# Altium schematic sheet CTR-Lower-Main-Board-Rev-C-BTLE.SchDoc: ZoZbot Lower Main Board - BTLE
size B; Author: RMG; Organization: OLogic, Inc.; DocumentNumber: LMB2; Revision: C; SheetNumber: 2; SheetTotal: 10; PageSetup: Record=PageOptions|CenterHorizontal=True|CenterVertical=True|PrintScale=0.70|XCorrection=1.00|YCorrection=1.00|PrintKind=0|BorderSize=5000000|LeftOffset=0|BottomOffset=0|Orientation=2|PaperLength=1000|PaperWidth=1000|Scale=100|PaperSource=15|PrintQuality=600|MediaType=1|DitherType=10|PrintScaleMode=1|PaperKind=Letter|PaperIndex=1
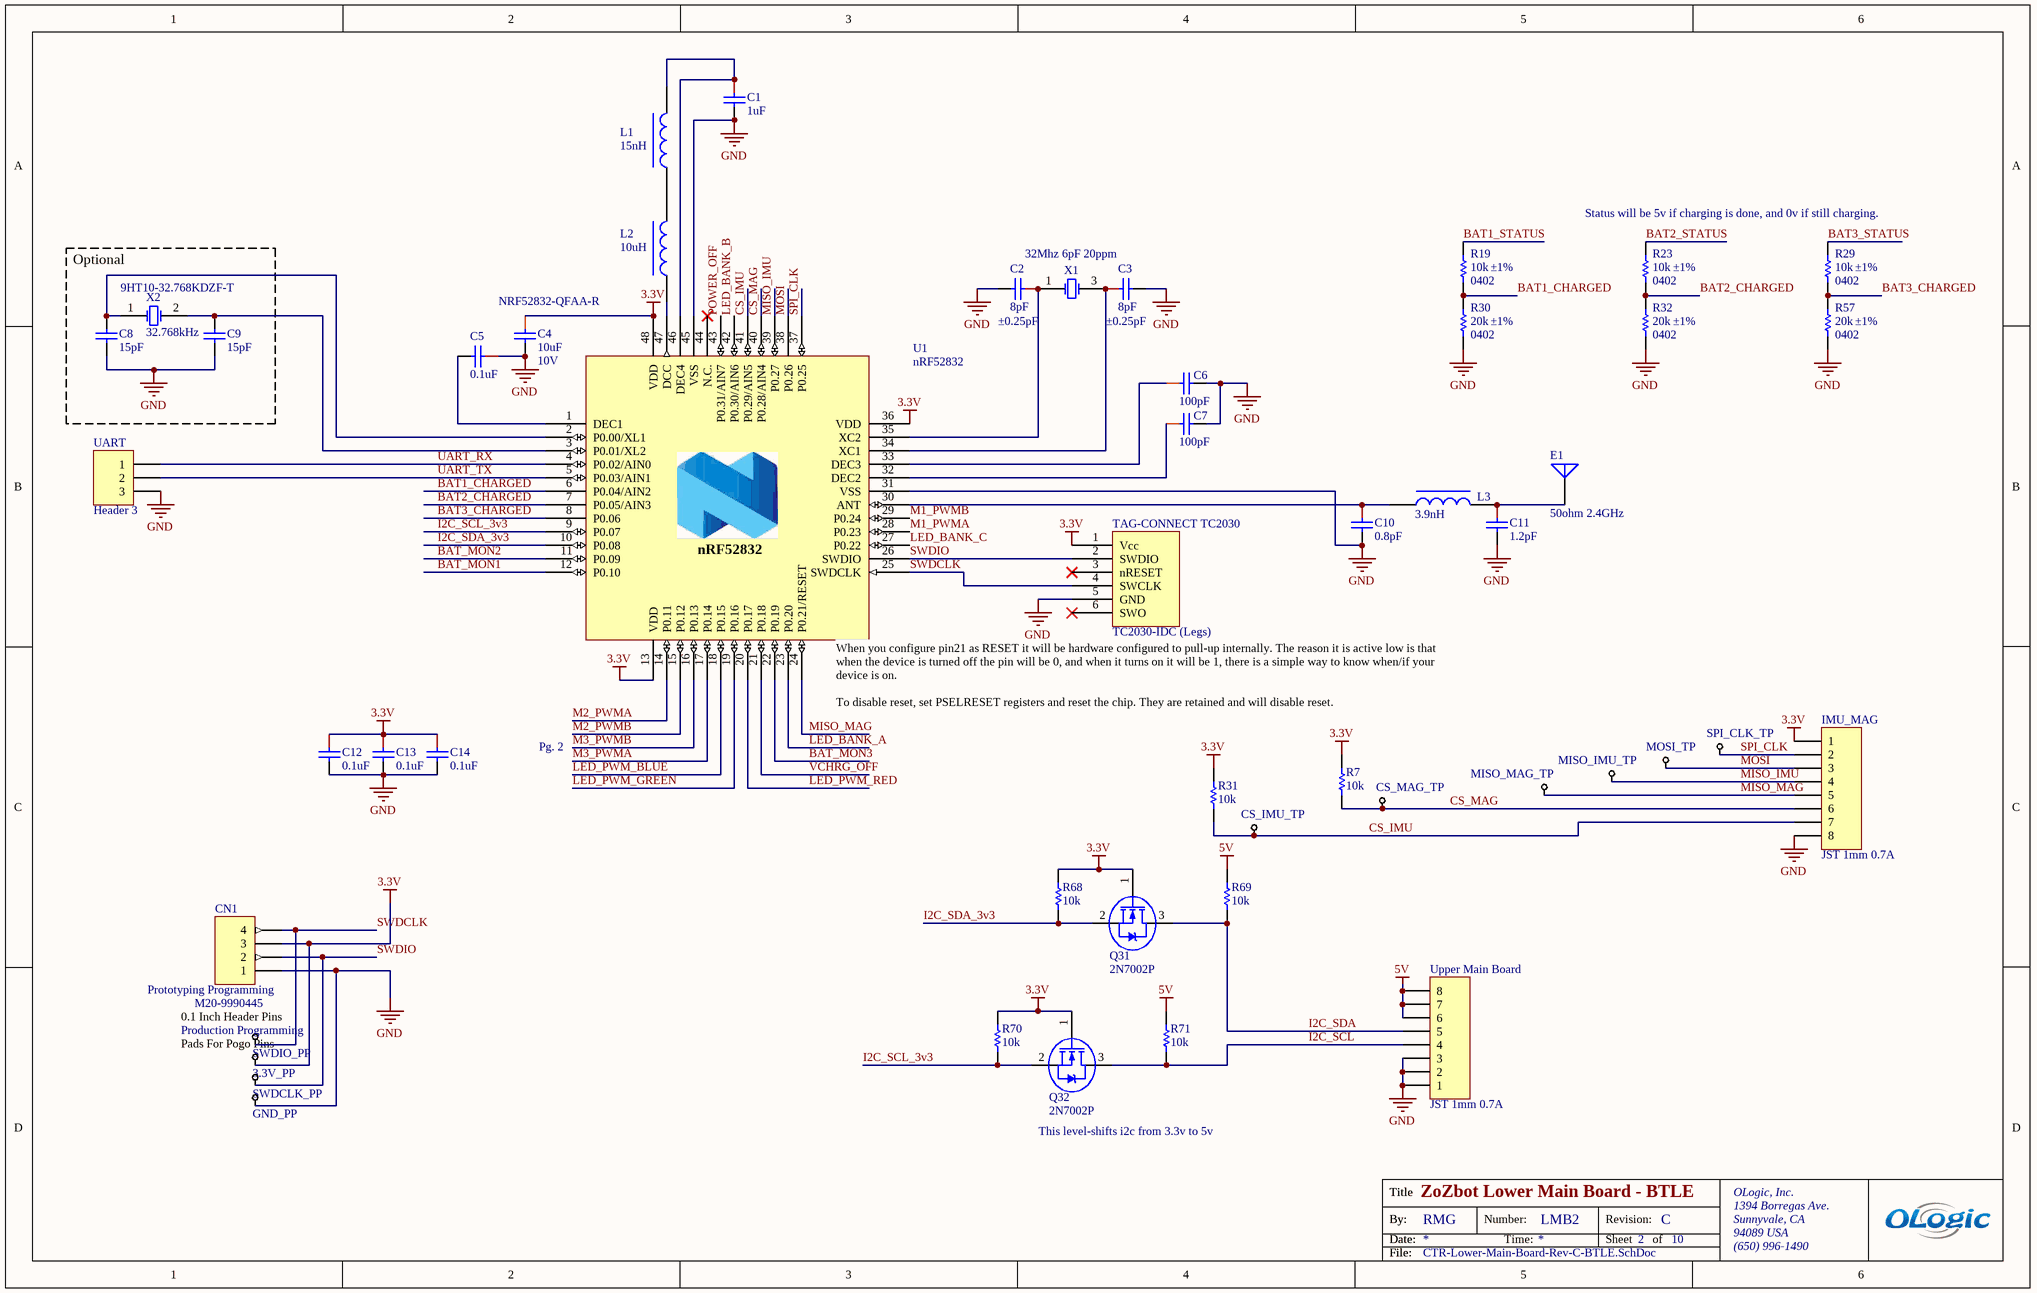
[diagram p0: CTR-Lower-Main-Board-Rev-C-BTLE.SchDoc]

## Parts
3.3V_PP  Test Point  [TestPoint-MD]  (value not drawn)  (no BOM)
C1  1uF  [CAPC0402(1005)_N]
C2  Capacitance: 8pF  Tolerance: ±0.25pF  [CAPC0402(1005)_N]  (hidden comment: CAP CER 8PF 50V +/- 0.25PF C0G 0402)
C3  Capacitance: 8pF  Tolerance: ±0.25pF  [CAPC0402(1005)_N]  (hidden comment: CAP CER 8PF 50V +/- 0.25PF C0G 0402)
C4  10uF  Voltage - Rated: 10V  [CAPC0805(2012)_L]
C5  0.1uF  [CAPC0402(1005)_N]
C6  100pF  [CAPC0402(1005)_N]
C7  100pF  [CAPC0402(1005)_N]
C8  15pF  [CAPC0402(1005)_N]
C9  15pF  [CAPC0402(1005)_N]
C10  0.8pF  [CAPC0402(1005)_N]
C11  1.2pF  [CAPC0402(1005)_N]
C12  0.1uF  [CAPC0402(1005)_N]
C13  0.1uF  [CAPC0402(1005)_N]
C14  0.1uF  [CAPC0402(1005)_N]
CN1  Prototyping Programming  Manufacturer Part Number: M20-9990445  [HDR1X4]
CS_IMU_TP  Test Point  [TestPoint-TH 42 mil]  (value not drawn)  (no BOM)
CS_MAG_TP  Test Point  [TestPoint-TH 42 mil]  (value not drawn)  (no BOM)
E1  50ohm 2.4GHz  [ANT-Trace-nRF51822]  (no BOM)
GND_PP  Test Point  [TestPoint-MD]  (value not drawn)  (no BOM)
IMU_MAG  JST 1mm 0.7A  [JST-BM08B-SRSS-TB]
L1  15nH  [IND-0402]
L2  10uH  [IND-0603]
L3  3.9nH  [IND-0402]
MISO_IMU_TP  Test Point  [TestPoint-TH 42 mil]  (value not drawn)  (no BOM)
MISO_MAG_TP  Test Point  [TestPoint-TH 42 mil]  (value not drawn)  (no BOM)
MOSI_TP  Test Point  [TestPoint-TH 42 mil]  (value not drawn)  (no BOM)
Q31  2N7002P  [SOT23]
Q32  2N7002P  [SOT23]
R7  10K  [RESC0402(1005)_N]
R19  Tolerance: ±1%  Supplier Device Package: 0402  [RESC0402(1005)_N]  (hidden comment: 10K)
R23  Tolerance: ±1%  Supplier Device Package: 0402  [RESC0402(1005)_N]  (hidden comment: 10K)
R29  Tolerance: ±1%  Supplier Device Package: 0402  [RESC0402(1005)_N]  (hidden comment: 10K)
R30  Tolerance: ±1%  Supplier Device Package: 0402  Resistance (Ohms): 20k  [RESC0402(1005)_N]  (hidden comment: 20K 0402)
R31  10K  [RESC0402(1005)_N]
R32  Tolerance: ±1%  Supplier Device Package: 0402  Resistance (Ohms): 20k  [RESC0402(1005)_N]  (hidden comment: 20K 0402)
R57  Tolerance: ±1%  Supplier Device Package: 0402  Resistance (Ohms): 20k  [RESC0402(1005)_N]  (hidden comment: 20K 0402)
R68  10K  [RESC0402(1005)_N]
R69  10K  [RESC0402(1005)_N]
R70  10K  [RESC0402(1005)_N]
R71  10K  [RESC0402(1005)_N]
SPI_CLK_TP  Test Point  [TestPoint-TH 42 mil]  (value not drawn)  (no BOM)
SWDCLK_PP  Test Point  [TestPoint-MD]  (value not drawn)  (no BOM)
SWDIO_PP  Test Point  [TestPoint-MD]  (value not drawn)  (no BOM)
TAG-CONNECT_TC2030  TC2030-IDC (Legs)  [TC2030-IDC]  (no BOM)
U1  nRF52832  Manufacturer Part Number: NRF52832-QFAA-R  [QFN40P600X600X90-48N]
UART  Header 3  [HDR1X3]
Upper_Main_Board  JST 1mm 0.7A  [JST-BM08B-SRSS-TB]
X1  32Mhz 6pF 20ppm  [SMXOSC/2X1.6]
X2  32.768kHz  Manufacturer Part Number: 9HT10-32.768KDZF-T  [FC-135]

## Blocks framed on the sheet
Optional: C8 C9 X2

## Nets
3.3V: 3.3V_PP.1 C4.1 C12.1 C13.1 C14.1 CN1.3 IMU_MAG.1 Q31.1(G) Q32.1(G) R7.2 R31.2 R68.2 R70.2 TAG-CONNECT_TC2030.1(Vcc) U1.13(VDD) U1.36(VDD) U1.48(VDD)
5V: R69.2 R71.2 Upper_Main_Board.6 Upper_Main_Board.7 Upper_Main_Board.8
GND: C1.2 C2.2 C3.2 C4.2 C5.1 C6.2 C7.2 C8.1 C9.1 C10.2 C11.2 C12.2 C13.2 C14.2 CN1.1 GND_PP.1 IMU_MAG.0 IMU_MAG.8 R30.1 R32.1 R57.1 TAG-CONNECT_TC2030.5(GND) U1.31(VSS) U1.45(VSS) U1.49(GND) UART.3 Upper_Main_Board.0 Upper_Main_Board.1 Upper_Main_Board.2 Upper_Main_Board.3 X1.2(NC) X1.4(NC)
BAT1_CHARGED: R19.1 R30.2 U1.6(P0.04/AIN2)
BAT1_STATUS: R19.2
BAT2_CHARGED: R23.1 R32.2 U1.7(P0.05/AIN3)
BAT2_STATUS: R23.2
BAT3_CHARGED: R29.1 R57.2 U1.8(P0.06)
BAT3_STATUS: R29.2
BAT_MON1: U1.12(P0.10)
BAT_MON2: U1.11(P0.09)
BAT_MON3: U1.22(P0.19)
CS_IMU: CS_IMU_TP.1 IMU_MAG.7 R31.1 U1.41(P0.29/AIN5)
CS_MAG: CS_MAG_TP.1 IMU_MAG.6 R7.1 U1.40(P0.28/AIN4)
I2C_SCL: Q32.3(D) R71.1 Upper_Main_Board.4
I2C_SCL_3v3: Q32.2(S) R70.1 U1.9(P0.07)
I2C_SDA: Q31.3(D) R69.1 Upper_Main_Board.5
I2C_SDA_3v3: Q31.2(S) R68.1 U1.10(P0.08)
LED_BANK_A: U1.23(P0.20)
LED_BANK_B: U1.42(P0.30/AIN6)
LED_BANK_C: U1.27(P0.22)
LED_PWM_BLUE: U1.18(P0.15)
LED_PWM_GREEN: U1.19(P0.16)
LED_PWM_RED: U1.20(P0.17)
M1_PWMA: U1.28(P0.23)
M1_PWMB: U1.29(P0.24)
M2_PWMA: U1.14(P0.11)
M2_PWMB: U1.15(P0.12)
M3_PWMA: U1.17(P0.14)
M3_PWMB: U1.16(P0.13)
MISO_IMU: IMU_MAG.4 MISO_IMU_TP.1 U1.39(P0.27)
MISO_MAG: IMU_MAG.5 MISO_MAG_TP.1 U1.24(P0.21/RESET)
MOSI: IMU_MAG.3 MOSI_TP.1 U1.38(P0.26)
POWER_OFF: U1.43(P0.31/AIN7)
SPI_CLK: IMU_MAG.2 SPI_CLK_TP.1 U1.37(P0.25)
SWDCLK: CN1.4 SWDIO_PP.1 TAG-CONNECT_TC2030.4(SWCLK) U1.25(SWDCLK)
SWDIO: CN1.2 SWDCLK_PP.1 TAG-CONNECT_TC2030.2(SWDIO) U1.26(SWDIO)
UART_RX: U1.4(P0.02/AIN0) UART.1
UART_TX: U1.5(P0.03/AIN1) UART.2
VCHRG_OFF: U1.21(P0.18)
NetC1_1: C1.1 L1.2 U1.46(DEC4)
NetC2_1: C2.1 U1.35(XC2) X1.1(OSC1)
NetC3_1: C3.1 U1.34(XC1) X1.3(OSC2)
NetC5_2: C5.2 U1.1(DEC1)
NetC6_1: C6.1 U1.33(DEC3)
NetC7_1: C7.1 U1.32(DEC2)
NetC8_2: C8.2 U1.2(P0.00/XL1) X2.1(OSC1)
NetC9_2: C9.2 U1.3(P0.01/XL2) X2.2(OSC2)
NetC10_1: C10.1 L3.1 U1.30(ANT)
NetC11_1: C11.1 E1.1(A) L3.2
NetL1_1: L1.1 L2.2
NetL2_1: L2.1 U1.47(DCC)

Not connected (* = marked no-connect by the designer): TAG-CONNECT_TC2030 3(nRESET)* 6(SWO)*; U1 44(N.C.)*

## Notes on the sheet
- Status will be 5v if charging is done, and 0v if still charging.
- Pg. 2
- (near U1) When you configure pin21 as RESET it will be hardware configured to pull-up internally. The reason it is active low is that when the device is turned off the pin will be 0, and when it turns on it will be 1, there is a simple way to know when/if your device is on.
  To disable reset, set PSELRESET registers and reset the chip. They are retained and will disable reset.
- 0.1 Inch Header Pins
- Pads For Pogo Pins
- Production Programming
- This level-shifts i2c from 3.3v to 5v
- Title
- By:
- Date:
- Number:
- Time:
- Revision:
- Sheet
- of
- OLogic, Inc.
- 1394 Borregas Ave.
- Sunnyvale, CA
- 94089 USA
- File:
- (650) 996-1490

## Library data of the parts
3.3V_PP CS_IMU_TP CS_MAG_TP GND_PP MISO_IMU_TP MISO_MAG_TP MOSI_TP SPI_CLK_TP SWDCLK_PP SWDIO_PP = TestPoint, small
C1 = CAP CER 1UF 16V 10% X5R 0402: 1UF 0402; Manufacturer: TDK Corporation; Manufacturer Part Number: C1005X5R1C105K050BC; Capacitance: 1.0µF; Tolerance: ±10%; Voltage - Rated: 16V; Temperature Coefficient: X5R; ClassName: CPU; Supplier 1: Digi-Key; RoHS: RoHS Compliant; Category: Capacitors; Stock 1: 490204; Pricing 1: 1=0.12, 10=0.08, 100=0.038, 250=0.032, 500=0.0268, 1000=0.022, 5000=0.0186 (USD); Packaging: Cut Tape (CT); Mounting Type: Surface Mount, MLCC; Operating Temperature: -55°C ~ 85°C; Applications: General Purpose; Ratings: -; Package / Case: 0402 (1005 Metric); Size / Dimension: 0.039" L x 0.020" W (1.00mm x 0.50mm); Height - Seated (Max): -; Thickness (Max): 0.022" (0.55mm); Lead Spacing: -; Features: -; Lead Style: -; ComponentLink1URL: http://product.tdk.com/en/catalog/datasheets/mlcc_commercial_general_en.pdf; ComponentLink1Description: http://product.tdk.com/en/catalog/datasheets/mlcc_commercial_general_en.pdf; Supplier Part Number 1: 445-4978-1-ND
C2 C3 = CAP CER 8PF 50V +/- 0.25PF C0G 0402: 8pF 0402; Manufacturer: TDK Corporation; Manufacturer Part Number: C1005C0G1H080C050BA; Temperature Coefficient: C0G, NP0; Supplier 1: Digi-Key; RoHS: RoHS Compliant; Category: Capacitors; Stock 1: 65983; Pricing 1: 1=0.1, 10=0.026, 100=0.0121, 250=0.00992, 500=0.00848, 1000=0.0066, 5000=0.0055 (USD); Packaging: Cut Tape (CT); Voltage - Rated: 50V; Mounting Type: Surface Mount, MLCC; Operating Temperature: -55°C ~ 125°C; Applications: General Purpose; Ratings: -; Package / Case: 0402 (1005 Metric); Size / Dimension: 0.039" L x 0.020" W (1.00mm x 0.50mm); Height - Seated (Max): -; Thickness (Max): 0.022" (0.55mm); Lead Spacing: -; Features: -; Lead Style: -; ComponentLink1URL: https://product.tdk.com/info/en/catalog/datasheets/mlcc_commercial_general_en.pdf; ComponentLink1Description: https://product.tdk.com/info/en/catalog/datasheets/mlcc_commercial_general_en.pdf; Supplier Part Number 1: 445-4890-1-ND; Creator: osman
C4 = CAP CER 10UF 10V Y5V 0805: 10uF 0805 10V; Manufacturer: Taiyo Yuden; Manufacturer Part Number: LMK212F106ZG-T; Capacitance: 10µF; Tolerance: -20%, +80%; Temperature Coefficient: Y5V (F); Supplier 1: Digi-Key; RoHS: RoHS Compliant; Category: Capacitors; Stock 1: 194456; Pricing 1: 1=0.17, 10=0.115, 50=0.0662, 100=0.0546, 250=0.046, 500=0.03852, 1000=0.03163 (USD); Packaging: Cut Tape (CT); Mounting Type: Surface Mount, MLCC; Operating Temperature: -30°C ~ 85°C; Applications: General Purpose; Ratings: -; Package / Case: 0805 (2012 Metric); Size / Dimension: 0.079" L x 0.049" W (2.00mm x 1.25mm); Height - Seated (Max): -; Thickness (Max): 0.053" (1.35mm); Lead Spacing: -; Features: -; Lead Style: -; ComponentLink1URL: http://www.yuden.co.jp/or/product/category/capacitor/LMK212F106ZG-T.pdf; ComponentLink1Description: http://www.yuden.co.jp/or/product/category/capacitor/LMK212F106ZG-T.pdf; Supplier Part Number 1: 587-1312-1-ND
C5 C12-C14 = CAP CER 0.1UF 50V 10% X7R 0402: 0.1uF 0402 50V; Manufacturer: TDK Corporation; Manufacturer Part Number: CGA2B3X7R1H104K050BB; Capacitance: 0.1µF; Tolerance: ±10%; Temperature Coefficient: X7R; Supplier 1: Digi-Key; RoHS: RoHS Compliant; Category: Capacitors; Stock 1: 1584397; Pricing 1: 1=0.16, 10=0.11, 100=0.0523, 250=0.044, 500=0.03686, 1000=0.03025, 5000=0.02558 (USD); Packaging: Cut Tape (CT); Voltage - Rated: 50V; Mounting Type: Surface Mount, MLCC; Operating Temperature: -55°C ~ 125°C; Applications: Automotive; Ratings: AEC-Q200; Package / Case: 0402 (1005 Metric); Size / Dimension: 0.039" L x 0.020" W (1.00mm x 0.50mm); Height - Seated (Max): -; Thickness (Max): 0.022" (0.55mm); Lead Spacing: -; Features: -; Lead Style: -; ComponentLink1URL: http://product.tdk.com/en/catalog/datasheets/mlcc_automotive_general_en.pdf; ComponentLink1Description: http://product.tdk.com/en/catalog/datasheets/mlcc_automotive_general_en.pdf; Supplier Part Number 1: 445-6899-1-ND; Creator: osman
  C12-C14: ClassName: CPU
C6 C7 = CAP CER 100PF 50V 5% NP0 0402: 100pF 0402 50V; Manufacturer: Murata Electronics North America; Manufacturer Part Number: GRM1555C1H101JA01D; Tolerance: ±5%; Temperature Coefficient: C0G, NP0; ClassName: CPU; Supplier 1: Digi-Key; RoHS: RoHS Compliant; Category: Capacitors; Stock 1: 1246257; Pricing 1: 1=0.1, 10=0.013, 50=0.007, 100=0.0059, 250=0.00488, 500=0.00416, 1000=0.00324, 5000=0.0027 (USD); Packaging: Cut Tape (CT); Capacitance: 100pF; Voltage - Rated: 50V; Mounting Type: Surface Mount, MLCC; Operating Temperature: -55°C ~ 125°C; Applications: General Purpose; Ratings: -; Package / Case: 0402 (1005 Metric); Size / Dimension: 0.039" L x 0.020" W (1.00mm x 0.50mm); Height - Seated (Max): -; Thickness (Max): 0.022" (0.55mm); Lead Spacing: -; Features: -; Lead Style: -; ComponentLink1URL: http://www.murata.com/~/media/webrenewal/support/library/catalog/products/capacitor/mlcc/c02e.ashx; ComponentLink1Description: http://www.murata.com/~/media/webrenewal/support/library/catalog/products/capacitor/mlcc/c02e.ashx; Supplier Part Number 1: 490-5922-1-ND
C8 = Capacitor: Manufacturer: Murata Electronics North America; Manufacturer Part Number: GRM1555C1H150JA01D; PN: 490-5888-1-ND; Vendor: Digikey; Tolerance: ±5%; Voltage - Rated: 50V; Temperature Coefficient: C0G, NP0; ClassName: CPU; Supplier 1: Digi-Key; Supplier Part Number 1: 490-5888-1-ND; RoHS: RoHS Compliant; Category: Capacitors; Stock 1: 332846; Pricing 1: 1=0.1, 10=0.013, 50=0.007, 100=0.0059, 250=0.0048, 500=0.00412, 1000=0.00315, 5000=0.00263 (USD); Packaging: Cut Tape (CT); Capacitance: 15pF; Mounting Type: Surface Mount, MLCC; Operating Temperature: -55°C ~ 125°C; Applications: General Purpose; Ratings: -; Package / Case: 0402 (1005 Metric); Size / Dimension: 0.039" L x 0.020" W (1.00mm x 0.50mm); Height - Seated (Max): -; Thickness (Max): 0.022" (0.55mm); Lead Spacing: -; Features: -; Lead Style: -; ComponentLink1URL: http://www.murata.com/~/media/webrenewal/support/library/catalog/products/capacitor/mlcc/c02e.ashx; ComponentLink1Description: http://www.murata.com/~/media/webrenewal/support/library/catalog/products/capacitor/mlcc/c02e.ashx
C9 = Capacitor: Manufacturer: TDK; MPN: C1608C0G1H150J080AA; Manufacturer Part Number: GRM1555C1H150JA01D; PN: 445-1271-1-ND; Vendor: Digikey; Tolerance: ±5%; Voltage - Rated: 50V; Temperature Coefficient: C0G, NP0; ClassName: CPU; Supplier 1: Digi-Key; Supplier Part Number 1: 490-5888-1-ND; RoHS: RoHS Compliant; Category: Capacitors; Stock 1: 332846; Pricing 1: 1=0.1, 10=0.013, 50=0.007, 100=0.0059, 250=0.0048, 500=0.00412, 1000=0.00315, 5000=0.00263 (USD); Packaging: Cut Tape (CT); Capacitance: 15pF; Mounting Type: Surface Mount, MLCC; Operating Temperature: -55°C ~ 125°C; Applications: General Purpose; Ratings: -; Package / Case: 0402 (1005 Metric); Size / Dimension: 0.039" L x 0.020" W (1.00mm x 0.50mm); Height - Seated (Max): -; Thickness (Max): 0.022" (0.55mm); Lead Spacing: -; Features: -; Lead Style: -; ComponentLink1URL: http://www.murata.com/~/media/webrenewal/support/library/catalog/products/capacitor/mlcc/c02e.ashx; ComponentLink1Description: http://www.murata.com/~/media/webrenewal/support/library/catalog/products/capacitor/mlcc/c02e.ashx
C10 = CAP CER 0.8pF 50V 0402: 0.8pF 0402; Manufacturer: Murata Electronics North America; Manufacturer Part Number: GJM1555C1HR80WB01D; Capacitance: 0.80pF; Tolerance: ±0.05pF; Voltage - Rated: 50V; Temperature Coefficient: C0G, NP0; Supplier 1: Digi-Key; RoHS: RoHS Compliant; Category: Capacitors; Stock 1: 18923; Pricing 1: 1=0.26, 10=0.216, 50=0.1216, 100=0.108, 250=0.081, 500=0.07156, 1000=0.06345, 5000=0.05265 (USD); Packaging: Cut Tape (CT); Part Status: Active; Operating Temperature: -55°C ~ 125°C; Features: High Q, Low Loss; Ratings: -; Applications: RF, Microwave, High Frequency; Failure Rate: *; Mounting Type: Surface Mount, MLCC; Package / Case: 0402 (1005 Metric); Size / Dimension: 0.039" L x 0.020" W (1.00mm x 0.50mm); Height - Seated (Max): -; Thickness (Max): 0.022" (0.55mm); Lead Spacing: -; Lead Style: -; ComponentLink1URL: http://www.murata.com/~/media/webrenewal/support/library/catalog/products/capacitor/mlcc/c02e.pdf; ComponentLink1Description: http://www.murata.com/~/media/webrenewal/support/library/catalog/products/capacitor/mlcc/c02e.pdf; Supplier Part Number 1: 490-11253-1-ND; ClassName: CPU
C11 = CAP CER 1.2PF 50V NP0 0402: 1.2pF 0402; Manufacturer: Murata Electronics North America; Manufacturer Part Number: GRM1555C1H1R2CA01D; Tolerance: ±0.25pF; Voltage - Rated: 50V; Temperature Coefficient: C0G, NP0; ClassName: CPU; Supplier 1: Digi-Key; RoHS: RoHS Compliant; Category: Capacitors; Stock 1: 91522; Pricing 1: 1=0.1, 10=0.028, 50=0.015, 100=0.0127, 250=0.01036, 500=0.00886, 1000=0.0069, 5000=0.00575 (USD); Packaging: Cut Tape (CT); Capacitance: 1.2pF; Mounting Type: Surface Mount, MLCC; Operating Temperature: -55°C ~ 125°C; Applications: General Purpose; Ratings: -; Package / Case: 0402 (1005 Metric); Size / Dimension: 0.039" L x 0.020" W (1.00mm x 0.50mm); Height - Seated (Max): -; Thickness (Max): 0.022" (0.55mm); Lead Spacing: -; Features: -; Lead Style: -; ComponentLink1URL: http://www.murata.com/~/media/webrenewal/support/library/catalog/products/capacitor/mlcc/c02e.ashx; ComponentLink1Description: http://www.murata.com/~/media/webrenewal/support/library/catalog/products/capacitor/mlcc/c02e.ashx; Supplier Part Number 1: 490-5927-1-ND
CN1 = Header 4: Header, 4-Pin; Manufacturer: Harwin Inc.; Connector Type: Header, Unshrouded, Breakaway; Pitch: 0.100" (2.54mm); Number of Positions: 4; Number of Positions Loaded: All; Supplier 1: Digi-Key; Supplier Part Number 1: 952-2265-ND; RoHS: RoHS Compliant; Category: Connectors, Interconnects; Stock 1: 1917; Pricing 1: 1=0.19, 10=0.18, 100=0.1248, 500=0.1056, 1000=0.0864, 5000=0.0768, 10000=0.0696 (USD); Packaging: Bulk; Part Status: Active; Contact Type: Male Pin; Number of Rows: 1; Row Spacing: -; Mounting Type: Through Hole; Termination: Solder; Fastening Type: -; Contact Mating Length: 0.240" (6.10mm); Features: -; Contact Finish: Gold; Contact Finish Thickness: -; Color: Black; ComponentLink1URL: https://cdn.harwin.com/pdfs/M20-999.pdf; ComponentLink1Description: https://cdn.harwin.com/pdfs/M20-999.pdf
E1 = Antenna2.4GHz: 2.4GHz Trace Antenna; ClassName: Radio
IMU_MAG Upper_Main_Board = JST-BM08B-SRSS-TB(LF)(SN): 1mm Locking Header, 8-Pin; Manufacturer: Japan Solderless Terminals (JST); No of Positions: 8; Style/Orientation: Vertical Header/Plug; Supplier 1: Digikey; Manufacturer Part Number: BM08B-SRSS-TB(LF)(SN); Stock 1: 18919; Pricing 1: 1=0.93, 10=0.814, 100=0.7024, 500=0.5747 (USD); Pitch: 1 mm; Type: Shrouded Header; Termination: Solder; ComponentLink1URL: https://datasheet.ciiva.com/730/esr-730608.pdf; ComponentLink1Description: https://datasheet.ciiva.com/730/esr-730608.pdf; ComponentLink2URL: https://datasheet.ciiva.com/26894/getdatasheetpartid-640965-26894529.pdf; ComponentLink2Description: https://datasheet.ciiva.com/26894/getdatasheetpartid-640965-26894529.pdf; ComponentLink3URL: https://datasheet.ciiva.com/712/esr-712616.pdf; ComponentLink3Description: https://datasheet.ciiva.com/712/esr-712616.pdf; ComponentLink4URL: https://datasheet.ciiva.com/712/esr-712617.pdf; ComponentLink4Description: https://datasheet.ciiva.com/712/esr-712617.pdf; ComponentLink5URL: https://datasheet.ciiva.com/8052/91630-8052091.pdf; ComponentLink5Description: https://datasheet.ciiva.com/8052/91630-8052091.pdf; ComponentLink6URL: https://datasheet.ciiva.com/16380/esr-16380526.pdf; ComponentLink6Description: https://datasheet.ciiva.com/16380/esr-16380526.pdf; Supplier Part Number 1: 455-1794-1-ND
L1 = INDUCTOR 15nH 0402 SMD: 15nH 0402; Manufacturer: Taiyo Yuden; Manufacturer Part Number: HK100515NJ-T; Type: Multilayer; Material - Core: Ferrite; Tolerance: ±5%; Current Rating: 320mA; Shielding: Unshielded; DC Resistance (DCR): 460 mOhm Max; Q @ Freq: 8 @ 100MHz; Frequency - Self Resonant: 2.3GHz; Frequency - Test: 100MHz; Supplier 1: Digi-Key; RoHS: RoHS Compliant; Category: Inductors, Coils, Chokes; Stock 1: 130590; Pricing 1: 1=0.1, 10=0.06, 25=0.054, 50=0.0468, 100=0.042, 250=0.039, 500=0.036, 1000=0.0312 (USD); Packaging: Cut Tape (CT); Part Status: Active; Inductance: 15nH; Current - Saturation: -; Ratings: -; Operating Temperature: -55°C ~ 125°C; Mounting Type: Surface Mount; Package / Case: 0402 (1005 Metric); Size / Dimension: 0.039" L x 0.020" W (1.00mm x 0.50mm); Height - Seated (Max): 0.022" (0.55mm); ComponentLink1URL: http://ds.yuden.co.jp/TYCOMPAS/ut/detail.do?productNo=HK100515NJ-T&fileName=HK100515NJ-T_SS&mode=specSheetDownload; ComponentLink1Description: http://ds.yuden.co.jp/TYCOMPAS/ut/detail.do?productNo=HK100515NJ-T&fileName=HK100515NJ-T_SS&mode=specSheetDownload; Supplier Part Number 1: 587-1521-1-ND; ClassName: CPU
L2 = INDUCTOR 10UH 5% 0603 SMD: 10uH 0603; Manufacturer: Taiyo Yuden; Manufacturer Part Number: LBMF1608T100K; Type: Wirewound; Inductance: 10µH; Tolerance: ±10%; Current Rating: 80mA; Shielding: Unshielded; DC Resistance (DCR): 360 mOhm; Frequency - Self Resonant: 32MHz; Frequency - Test: 2.52MHz; Supplier 1: Digi-Key; RoHS: RoHS Compliant; Category: Inductors, Coils, Chokes; Stock 1: 49989; Pricing 1: 1=0.25, 10=0.225, 25=0.2024, 50=0.1756, 100=0.1575, 250=0.14624, 500=0.135, 1000=0.117 (USD); Packaging: Cut Tape (CT); Part Status: Active; Material - Core: -; Current - Saturation: -; Q @ Freq: -; Ratings: -; Operating Temperature: -40°C ~ 105°C; Mounting Type: Surface Mount; Package / Case: 0603 (1608 Metric); Size / Dimension: 0.063" L x 0.031" W (1.60mm x 0.80mm); Height - Seated (Max): 0.039" (1.00mm); ComponentLink1URL: http://ds.yuden.co.jp/TYCOMPAS/ut/detail.do?productNo=LBMF1608T100K&fileName=LBMF1608T100K_SS&mode=specSheetDownload; ComponentLink1Description: http://ds.yuden.co.jp/TYCOMPAS/ut/detail.do?productNo=LBMF1608T100K&fileName=LBMF1608T100K_SS&mode=specSheetDownload; Supplier Part Number 1: 587-1714-1-ND; ClassName: CPU
L3 = INDUCTOR 3.9nH 0402 SMD: 3.9nH 0402; Manufacturer: Murata Electronics North America; Manufacturer Part Number: LQP15MN3N9B02D; Type: Thin Film; Material - Core: Non-Magnetic; Tolerance: ±0.1nH; Current Rating: 170mA; Shielding: Unshielded; DC Resistance (DCR): 500 mOhm Max; Q @ Freq: 13 @ 500MHz; Frequency - Self Resonant: 6GHz; Frequency - Test: 500MHz; Supplier 1: Digi-Key; RoHS: RoHS Compliant; Category: Inductors, Coils, Chokes; Stock 1: 45413; Pricing 1: 1=0.18, 10=0.167, 25=0.1504, 50=0.1302, 100=0.1169, 250=0.10856, 500=0.1002, 750=0.09519, 1000=0.08684 (USD); Packaging: Cut Tape (CT); Part Status: Active; Inductance: 3.9nH; Current - Saturation: -; Ratings: -; Operating Temperature: -40°C ~ 85°C; Mounting Type: Surface Mount; Package / Case: 0402 (1005 Metric); Size / Dimension: 0.039" L x 0.020" W (1.00mm x 0.50mm); Height - Seated (Max): 0.018" (0.45mm); ComponentLink1URL: http://search.murata.co.jp/Ceramy/image/img/PDF/ENG/L0075S0084LQP15M.pdf; ComponentLink1Description: http://search.murata.co.jp/Ceramy/image/img/PDF/ENG/L0075S0084LQP15M.pdf; Supplier Part Number 1: 490-1131-1-ND; ClassName: CPU
Q31 Q32 = 2N7002P: MOSFET N-CH 60V 0.36A SOT-23; Manufacturer: Nexperia USA Inc.; Manufacturer Part Number: 2N7002P,235; FET Type: N-Channel; Current - Continuous Drain (Id) @ 25°C: 360mA (Ta); Rds On (Max) @ Id, Vgs: 1.6 Ohm @ 500mA, 10V; Vgs(th) (Max) @ Id: 2.4V @ 250µA; Drive Voltage (Max Rds On,  Min Rds On): 10V; Gate Charge (Qg) (Max) @ Vgs: 0.8nC @ 4.5V; Input Capacitance (Ciss) (Max) @ Vds: 50pF @ 10V; Power Dissipation (Max): 350mW (Ta); Vgs (Max): ±20V; Supplier 1: Digi-Key; RoHS: RoHS Compliant; Category: Discrete Semiconductor Products; Stock 1: 77037; Pricing 1: 1=0.15, 10=0.135, 100=0.0735, 500=0.04522, 1000=0.03084 (USD); Packaging: Cut Tape (CT); FET Feature: -; Drain to Source Voltage (Vdss): 60V; Mounting Type: Surface Mount; Package / Case: TO-236-3, SC-59, SOT-23-3; Supplier Device Package: TO-236AB (SOT23); ComponentLink1URL: http://assets.nexperia.com/documents/data-sheet/2N7002P.pdf; ComponentLink1Description: http://assets.nexperia.com/documents/data-sheet/2N7002P.pdf; Supplier Part Number 1: 1727-1865-1-ND; Operating Temperature: -55°C ~ 150°C (TJ); Part Status: Active; Technology: MOSFET (Metal Oxide)
R7 R31 R68-R71 = RES 10K OHM 1% 1/10W 0402: 10K 0402; Manufacturer: Panasonic Electronic Components; Manufacturer Part Number: ERJ-2RKF1002X; Tolerance: ±1%; Power (Watts): 0.1W, 1/10W; Temperature Coefficient: ±100ppm/°C; ClassName: power; Supplier 1: Digi-Key; RoHS: RoHS Compliant; Category: Resistors; Stock 1: 8784573; Pricing 1: 1=0.1, 50=0.0196, 100=0.0149, 250=0.01104, 500=0.00816, 1000=0.00544, 5000=0.00383 (USD); Packaging: Cut Tape (CT); Composition: Thick Film; Features: Automotive AEC-Q200; Operating Temperature: -55°C ~ 155°C; Package / Case: 0402 (1005 Metric); Supplier Device Package: 0402; Size / Dimension: 0.039" L x 0.020" W (1.00mm x 0.50mm); Height: 0.016" (0.40mm); Number of Terminations: 2; ComponentLink1URL: http://industrial.panasonic.com/www-cgi/jvcr13pz.cgi?E+PZ+3+AOA0002+ERJ2RKF1002X+7+WW; ComponentLink1Description: http://industrial.panasonic.com/www-cgi/jvcr13pz.cgi?E+PZ+3+AOA0002+ERJ2RKF1002X+7+WW; Supplier Part Number 1: P10.0KLCT-ND; Creator: osman; Resistance (Ohms): 10k
R19 R23 R29 = RES 10K OHM 1% 1/10W 0402: 10K 0402; Manufacturer: Panasonic Electronic Components; Manufacturer Part Number: ERJ-2RKF1002X; Power (Watts): 0.1W, 1/10W; Temperature Coefficient: ±100ppm/°C; Supplier 1: Digi-Key; RoHS: RoHS Compliant; Category: Resistors; Stock 1: 8784573; Pricing 1: 1=0.1, 50=0.0196, 100=0.0149, 250=0.01104, 500=0.00816, 1000=0.00544, 5000=0.00383 (USD); Packaging: Cut Tape (CT); Composition: Thick Film; Features: Automotive AEC-Q200; Operating Temperature: -55°C ~ 155°C; Package / Case: 0402 (1005 Metric); Size / Dimension: 0.039" L x 0.020" W (1.00mm x 0.50mm); Height: 0.016" (0.40mm); Number of Terminations: 2; ComponentLink1URL: http://industrial.panasonic.com/www-cgi/jvcr13pz.cgi?E+PZ+3+AOA0002+ERJ2RKF1002X+7+WW; ComponentLink1Description: http://industrial.panasonic.com/www-cgi/jvcr13pz.cgi?E+PZ+3+AOA0002+ERJ2RKF1002X+7+WW; Supplier Part Number 1: P10.0KLCT-ND; Creator: osman; Resistance (Ohms): 10k
R30 R32 R57 = RES 20K OHM 1% 1/10W 0402: Manufacturer: Panasonic Electronic Components; Manufacturer Part Number: ERJ-2RKF2002X; Power (Watts): 0.1W, 1/10W; Temperature Coefficient: ±100ppm/°C; Supplier 1: Digi-Key; RoHS: RoHS Compliant; Category: Resistors; Stock 1: 1265803; Pricing 1: 1=0.1, 50=0.0196, 100=0.0149, 250=0.01104, 500=0.00816, 1000=0.00544, 5000=0.00383 (USD); Packaging: Cut Tape (CT); Composition: Thick Film; Features: Automotive AEC-Q200; Operating Temperature: -55°C ~ 155°C; Package / Case: 0402 (1005 Metric); Size / Dimension: 0.039" L x 0.020" W (1.00mm x 0.50mm); Height: 0.016" (0.40mm); Number of Terminations: 2; ComponentLink1URL: http://industrial.panasonic.com/www-cgi/jvcr13pz.cgi?E+PZ+3+AOA0002+ERJ2RKF2002X+7+WW; ComponentLink1Description: http://industrial.panasonic.com/www-cgi/jvcr13pz.cgi?E+PZ+3+AOA0002+ERJ2RKF2002X+7+WW; Supplier Part Number 1: P20.0KLCT-ND
TAG-CONNECT_TC2030 = TC2030-IDC (Legs): Manufacturer: Tag-Connect; Accessory Type: Adapter Cable; Other Names: Q8082613A; Supplier 1: Digikey; Manufacturer Part Number: TC2030-IDC; Stock 1: 0; Pricing 1: 7=42.4371 (USD); Standard Package: 1; Category: Programmers, Development Systems; Family: Accessories; Series: Plug-Of-Nails™; Supplier Part Number 1: TC2030-IDC-ND
U1 = nRF52832_QFAA: Multi-protocol Bluetooth Low Energy and 2.4GHz proprietary system-on-chip; Manufacturer: Nordic Semiconductor ASA; RF Family/Standard: Bluetooth, General ISM > 1GHz; Protocol: Bluetooth v4.1; Modulation: GFSK; Data Rate (Max): 2Mbps; Power - Output: 4dBm; Sensitivity: -96dBm; Memory Size: 512kB Flash, 64kB RAM; Serial Interfaces: I²C, SPI, UART; GPIO: 32; Voltage - Supply: 1.7 V ~ 3.6 V; Current - Receiving: 5.5mA ~ 10.4mA; Current - Transmitting: 5.5mA ~ 15.2mA; Supplier 1: Digi-Key; Supplier Part Number 1: 1490-1052-1-ND; RoHS: RoHS Compliant; Category: RF/IF and RFID; Stock 1: 53533; Pricing 1: 1=5.73, 10=5.119, 25=4.6068, 100=4.1974, 250=3.78788, 500=3.39886, 1000=2.8665 (USD); Packaging: Cut Tape (CT); Part Status: Active; Type: TxRx + MCU; Frequency: 2.4GHz; Operating Temperature: -40°C ~ 85°C; Package / Case: 48-VFQFN Exposed Pad; ComponentLink1URL: http://www.nordicsemi.com/eng/nordic/download_resource/48726/2/69583307; ComponentLink1Description: http://www.nordicsemi.com/eng/nordic/download_resource/48726/2/69583307
UART = Header 3: Header, 3-Pin; Manufacturer: Sullins Connector Solutions; Manufacturer Part Number: PRPC003SAAN-RC; Connector Type: Header, Unshrouded, Breakaway; Number of Positions: 3; Number of Positions Loaded: All; Pitch: 0.100" (2.54mm); Supplier 1: Digi-Key; RoHS: RoHS Compliant; Category: Connectors, Interconnects; Stock 1: 0; Pricing 1: 1=0.18, 10=0.16, 100=0.132, 500=0.10438, 1000=0.0896, 5000=0.08174, 10000=0.0786 (USD); Packaging: Bulk; Contact Type: Male Pin; Number of Rows: 1; Row Spacing: -; Contact Mating Length: 0.230" (5.84mm); Mounting Type: Through Hole; Termination: Solder; Fastening Type: -; Features: -; Contact Finish: Gold; Contact Finish Thickness: Flash; Color: Black; ComponentLink1URL: http://media.digikey.com/PDF/Data%20Sheets/Sullins%20PDFs/xRxCzzzSxxN-RC_ST_11635-B.pdf; ComponentLink1Description: http://media.digikey.com/PDF/Data%20Sheets/Sullins%20PDFs/xRxCzzzSxxN-RC_ST_11635-B.pdf; Supplier Part Number 1: S1011EC-03-ND
X1 = CRYSTAL 32.0000MHZ 6PF SMD: 32MHz ±20ppm Crystal 6pF 70 Ohm -30°C ~ 85°C Surface Mount 4-SMD, No Lead; Manufacturer: Murata Electronics North America; Manufacturer Part Number: XRCGB32M000F2P10R0; ESR (Equivalent Series Resistance): 70 Ohm; Operating Mode: Fundamental; Supplier 1: Digi-Key; RoHS: RoHS Compliant; Category: Crystals, Oscillators, Resonators; Stock 1: 3094; Pricing 1: 1=0.4, 10=0.334, 50=0.3008, 100=0.2673, 500=0.25394, 1000=0.21384 (USD); Packaging: Cut Tape (CT); Part Status: Active; Type: MHz Crystal; Frequency: 32MHz; Frequency Stability: ±20ppm; Frequency Tolerance: ±20ppm; Load Capacitance: 6pF; Operating Temperature: -30°C ~ 85°C; Ratings: -; Mounting Type: Surface Mount; Package / Case: 4-SMD, No Lead; Size / Dimension: 0.079" L x 0.063" W (2.00mm x 1.60mm); Height - Seated (Max): 0.028" (0.70mm); ComponentLink1URL: http://www.murata.com/~/media/webrenewal/support/library/catalog/products/timingdevice/crystalu/p79e.ashx; ComponentLink1Description: http://www.murata.com/~/media/webrenewal/support/library/catalog/products/timingdevice/crystalu/p79e.ashx; Supplier Part Number 1: 490-14308-1-ND
X2 = CRYSTAL 32.768KHZ 12.5PF 2-SMD: 32.768kHz 12.5PF 2-SMD; Manufacturer: TXC CORPORATION; Frequency Tolerance: ±20ppm; ESR (Equivalent Series Resistance): 70 kOhm; Operating Mode: Fundamental; ClassName: *; Supplier 1: Digi-Key; RoHS: RoHS Compliant; Category: Crystals and Oscillators; Stock 1: 6355; Pricing 1: 1=0.66, 10=0.581, 50=0.5424, 100=0.48, 500=0.4536, 1000=0.3792 (USD); Packaging: Cut Tape (CT); Type: kHz Crystal (Tuning Fork); Frequency: 32.768kHz; Frequency Stability: -; Load Capacitance: 12.5pF; Operating Temperature: -40°C ~ 85°C; Ratings: -; Mounting Type: Surface Mount; Package / Case: 2-SMD; Size / Dimension: 0.126" L x 0.059" W (3.20mm x 1.50mm); Height: 0.033" (0.85mm); ComponentLink1URL: http://www.txccrystal.com/images/pdf/9ht10.pdf; ComponentLink1Description: http://www.txccrystal.com/images/pdf/9ht10.pdf; Supplier Part Number 1: 887-1504-1-ND